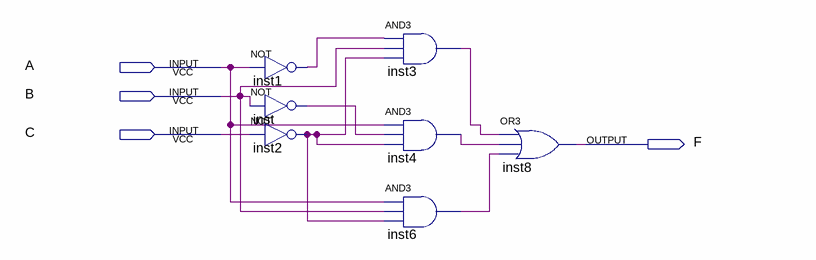
[diagram p0: schematic sheet]
// Quartus schematic lab2step1.bdf as structural Verilog: 7 symbols, 4 pins
module lab2step1 (
  input  A,
  input  B,
  input  C,
  output F
);

  wire inst1_out, inst2_out, inst3_out, inst4_out, inst6_out, inst_out;

  not inst1 (inst1_out, A);
  not inst (inst_out, B);
  not inst2 (inst2_out, C);
  and inst3 (inst3_out, inst1_out, B, inst2_out);
  and inst4 (inst4_out, A, inst_out, inst2_out);
  and inst6 (inst6_out, A, B, inst2_out);
  or inst8 (F, inst3_out, inst4_out, inst6_out);
endmodule
